# Altium project PCB_MAIN_BOARD.PrjPcb
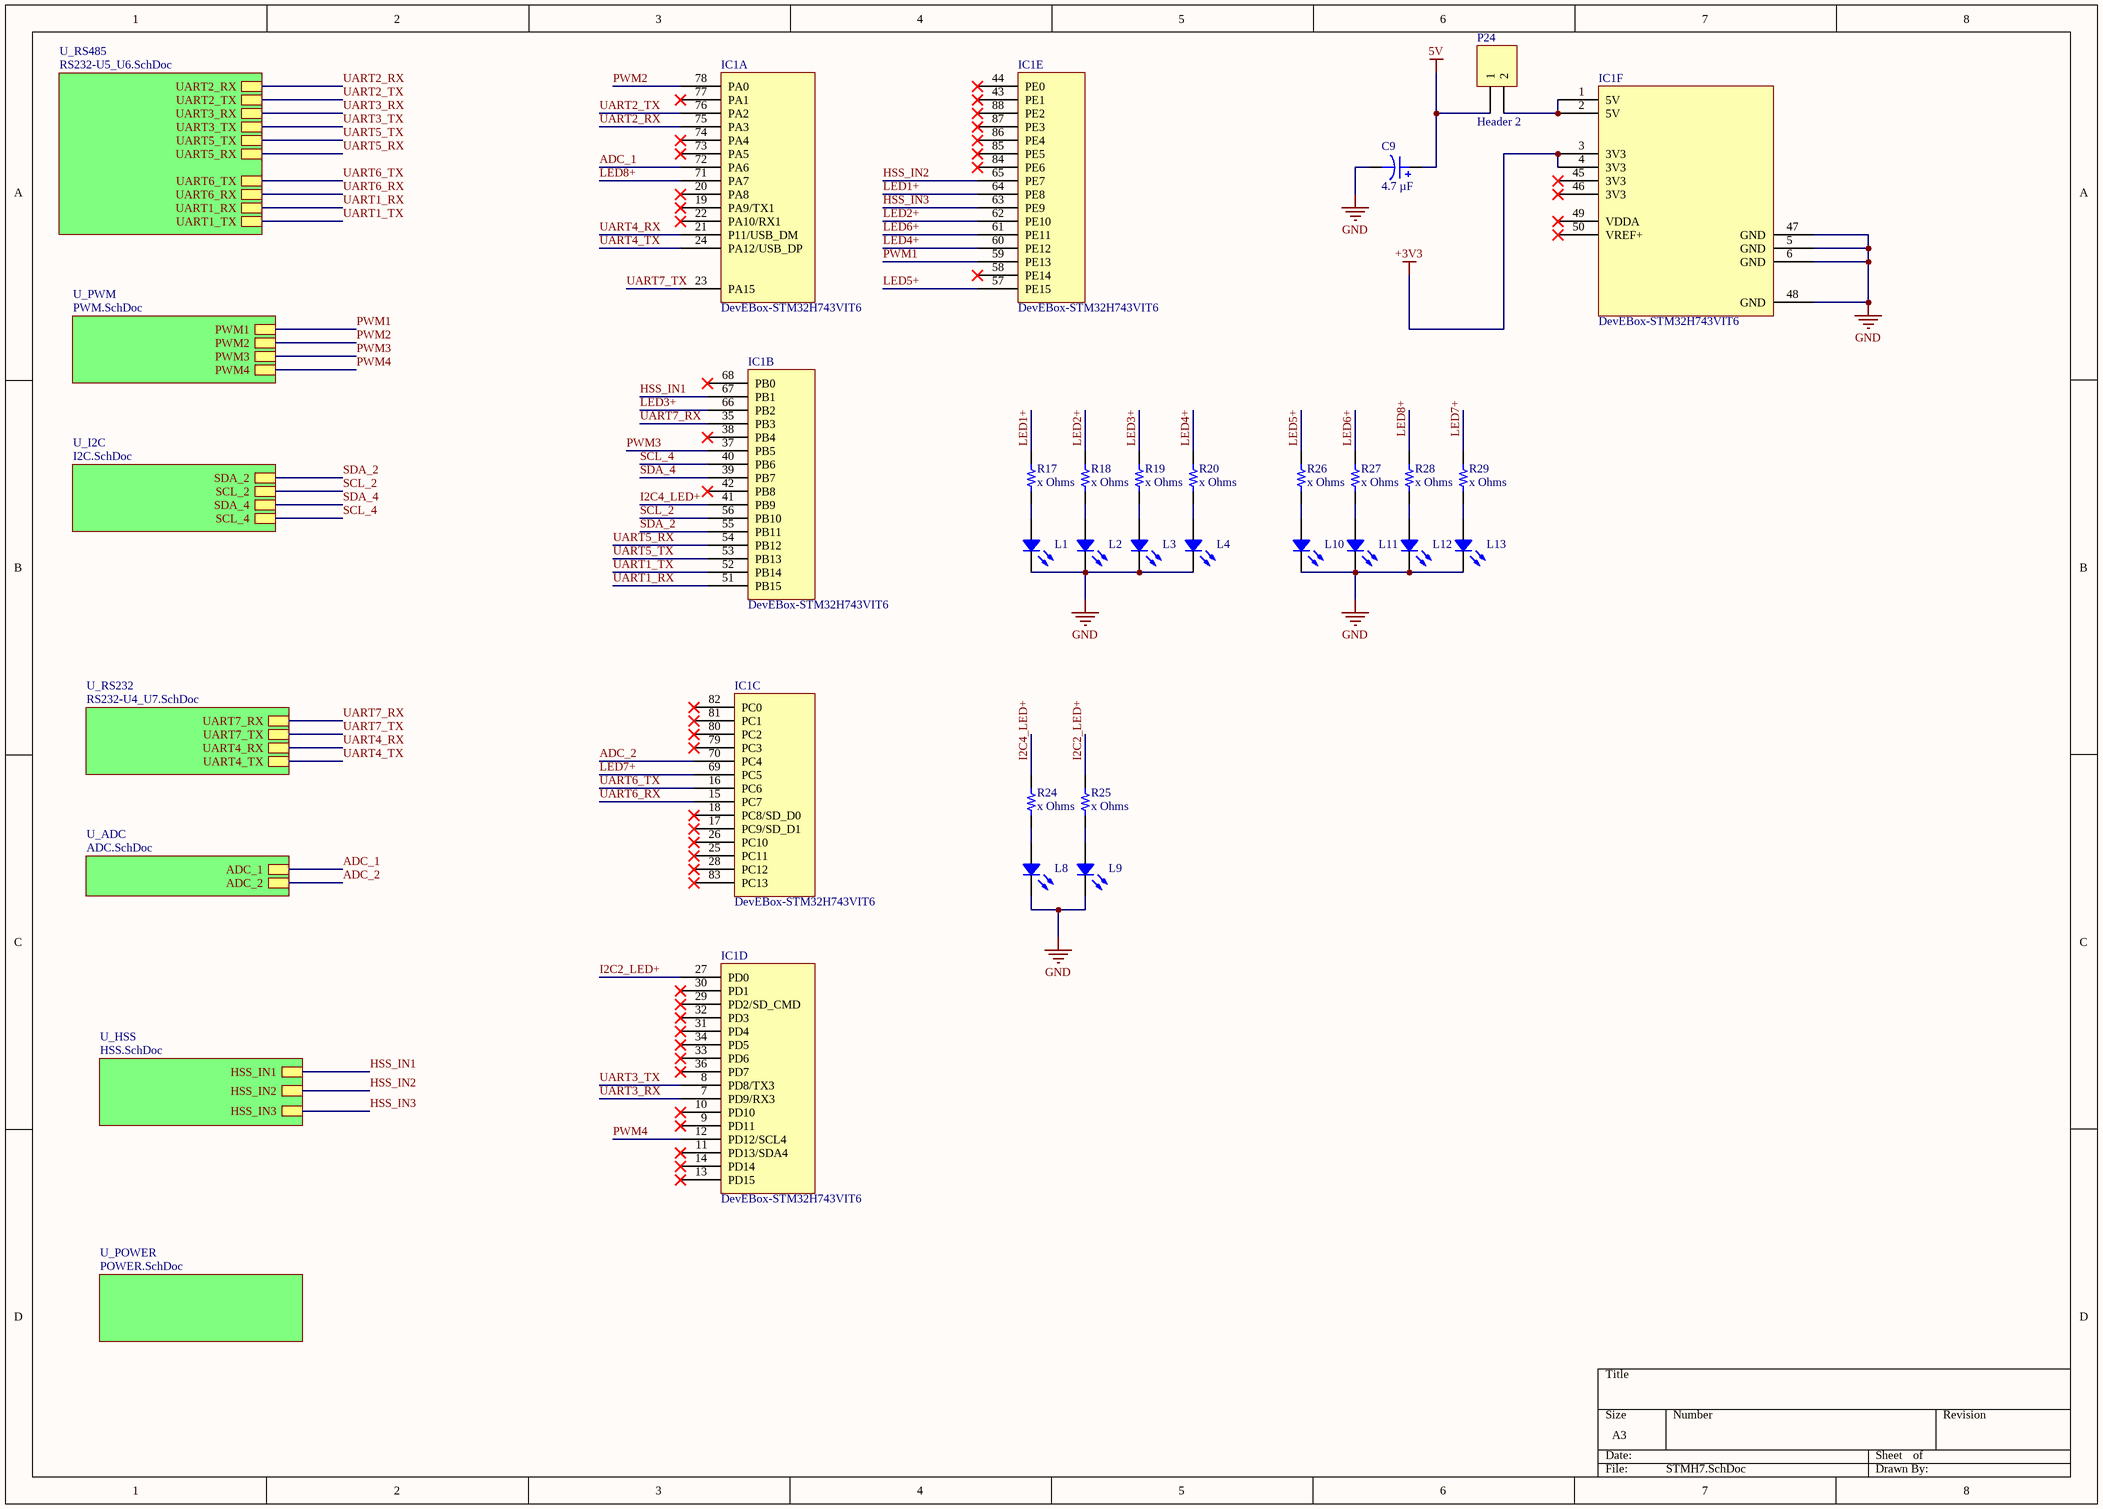
[diagram p0: STMH7.SchDoc]
8 sheets, 95 parts. Net scope: hierarchical (ports join the sheet entries above them; power ports are global).
Board file: MAINBOARD.PcbDoc
Sheets:
  STMH7.SchDoc
    U_RS232 = RS232-U4_U7.SchDoc
    U_RS485 = RS232-U5_U6.SchDoc
    U_PWM = PWM.SchDoc
    U_I2C = I2C.SchDoc
    U_ADC = ADC.SchDoc
    U_HSS = HSS.SchDoc
    U_POWER = POWER.SchDoc

## Sheet STMH7.SchDoc
size A3

### Parts
C9  4.7 µF  [CAP ALSMD 4.3MM H5.4MM]
IC1  DevEBox-STM32H743VIT6  [DevEBox-STM32H743VIT6]  (parts A,B,C,D,E,F of 6)
L1  LED_SMD  [LED_SMD]  (value not drawn)
L2  LED_SMD  [LED_SMD]  (value not drawn)
L3  LED_SMD  [LED_SMD]  (value not drawn)
L4  LED_SMD  [LED_SMD]  (value not drawn)
L8  LED_SMD  [LED_SMD]  (value not drawn)
L9  LED_SMD  [LED_SMD]  (value not drawn)
L10  LED_SMD  [LED_SMD]  (value not drawn)
L11  LED_SMD  [LED_SMD]  (value not drawn)
L12  LED_SMD  [LED_SMD]  (value not drawn)
L13  LED_SMD  [LED_SMD]  (value not drawn)
P24  Header 2  [HDR1X2]
R17  x Ohms  [RES 1206_3216 RF]
R18  x Ohms  [RES 1206_3216 RF]
R19  x Ohms  [RES 1206_3216 RF]
R20  x Ohms  [RES 1206_3216 RF]
R24  x Ohms  [RES 1206_3216 RF]
R25  x Ohms  [RES 1206_3216 RF]
R26  x Ohms  [RES 1206_3216 RF]
R27  x Ohms  [RES 1206_3216 RF]
R28  x Ohms  [RES 1206_3216 RF]
R29  x Ohms  [RES 1206_3216 RF]

### Sub-sheets
U_ADC = ADC.SchDoc: ADC_1, ADC_2
U_HSS = HSS.SchDoc: HSS_IN1, HSS_IN2, HSS_IN3
U_I2C = I2C.SchDoc: SDA_2, SCL_2, SDA_4, SCL_4
U_POWER = POWER.SchDoc: no entries
U_PWM = PWM.SchDoc: PWM1, PWM2, PWM4, PWM3
U_RS232 = RS232-U4_U7.SchDoc: UART7_RX, UART7_TX, UART4_RX, UART4_TX
U_RS485 = RS232-U5_U6.SchDoc: UART2_RX, UART2_TX, UART3_RX, UART3_TX, UART5_TX, UART5_RX, UART6_TX, UART6_RX, UART1_RX, UART1_TX

### Nets
5V: C9.1 P24.1
+3V3: IC1.3(3V3) IC1.4(3V3)
GND: C9.2 IC1.5(GND) IC1.6(GND) IC1.47(GND) IC1.48(GND) L1.2 L2.2 L3.2 L4.2 L8.2 L9.2 L10.2 L11.2 L12.2 L13.2
ADC_1: IC1.72(PA6) ; sheet U_ADC/ADC_1
ADC_2: IC1.70(PC4) ; sheet U_ADC/ADC_2
HSS_IN1: IC1.67(PB1) ; sheet U_HSS/HSS_IN1
HSS_IN2: IC1.65(PE7) ; sheet U_HSS/HSS_IN2
HSS_IN3: IC1.63(PE9) ; sheet U_HSS/HSS_IN3
I2C2_LED+: IC1.27(PD0) R25.2
I2C4_LED+: IC1.41(PB9) R24.2
LED1+: IC1.64(PE8) R17.2
LED2+: IC1.62(PE10) R18.2
LED3+: IC1.66(PB2) R19.2
LED4+: IC1.60(PE12) R20.2
LED5+: IC1.57(PE15) R26.2
LED6+: IC1.61(PE11) R27.2
LED7+: IC1.69(PC5) R29.2
LED8+: IC1.71(PA7) R28.2
PWM1: IC1.59(PE13) ; sheet U_PWM/PWM1
PWM2: IC1.78(PA0) ; sheet U_PWM/PWM2
PWM3: IC1.37(PB5) ; sheet U_PWM/PWM3
PWM4: IC1.12(PD12/SCL4) ; sheet U_PWM/PWM4
SCL_2: IC1.56(PB10) ; sheet U_I2C/SCL_2
SCL_4: IC1.40(PB6) ; sheet U_I2C/SCL_4
SDA_2: IC1.55(PB11) ; sheet U_I2C/SDA_2
SDA_4: IC1.39(PB7) ; sheet U_I2C/SDA_4
UART1_RX: IC1.51(PB15) ; sheet U_RS485/UART1_RX
UART1_TX: IC1.52(PB14) ; sheet U_RS485/UART1_TX
UART2_RX: IC1.75(PA3) ; sheet U_RS485/UART2_RX
UART2_TX: IC1.76(PA2) ; sheet U_RS485/UART2_TX
UART3_RX: IC1.7(PD9/RX3) ; sheet U_RS485/UART3_RX
UART3_TX: IC1.8(PD8/TX3) ; sheet U_RS485/UART3_TX
UART4_RX: IC1.21(P11/USB_DM) ; sheet U_RS232/UART4_RX
UART4_TX: IC1.24(PA12/USB_DP) ; sheet U_RS232/UART4_TX
UART5_RX: IC1.54(PB12) ; sheet U_RS485/UART5_RX
UART5_TX: IC1.53(PB13) ; sheet U_RS485/UART5_TX
UART6_RX: IC1.15(PC7) ; sheet U_RS485/UART6_RX
UART6_TX: IC1.16(PC6) ; sheet U_RS485/UART6_TX
UART7_RX: IC1.35(PB3) ; sheet U_RS232/UART7_RX
UART7_TX: IC1.23(PA15) ; sheet U_RS232/UART7_TX
NetIC1_1: IC1.1(5V) IC1.2(5V) P24.2
NetL1_1: L1.1 R17.1
NetL2_1: L2.1 R18.1
NetL3_1: L3.1 R19.1
NetL4_1: L4.1 R20.1
NetL8_1: L8.1 R24.1
NetL9_1: L9.1 R25.1
NetL10_1: L10.1 R26.1
NetL11_1: L11.1 R27.1
NetL12_1: L12.1 R28.1
NetL13_1: L13.1 R29.1

Not connected (* = marked no-connect by the designer): IC1 9(PD11)* 10(PD10)* 11(PD13/SDA4)* 13(PD15)* 14(PD14)* 17(PC9/SD_D1)* 18(PC8/SD_D0)* 19(PA9/TX1)* 20(PA8)* 22(PA10/RX1)* 25(PC11)* 26(PC10)* 28(PC12)* 29(PD2/SD_CMD)* 30(PD1)* 31(PD4)* 32(PD3)* 33(PD6)* 34(PD5)* 36(PD7)* 38(PB4)* 42(PB8)* 43(PE1)* 44(PE0)* 45(3V3)* 46(3V3)* 49(VDDA)* 50(VREF+)* 58(PE14)* 68(PB0)* 73(PA5)* 74(PA4)* 77(PA1)* 79(PC3)* 80(PC2)* 81(PC1)* 82(PC0)* 83(PC13)* 84(PE6)* 85(PE5)* 86(PE4)* 87(PE3)* 88(PE2)*

### Library data of the parts
C9 = EMVE350ADA4R7MD55G: CAP ALUM 4.7UF 20% 35V SMD; manufacturer: United Chemi-Con; Lifetime @ Temp.: 1000 Hrs @ 105°C; Polarization: Polar; Ripple Current @ Low Frequency: 16 mA @ 120 Hz; Surface Mount Land Size: 0.169" L x 0.169" W (4.30mm x 4.30mm); Part Number: EMVE350ADA4R7MD55G; Applications: General Purpose; Capacitance: 4.7 µF; componentlink1description: Datasheet; componentlink1url: //media.digikey.com/pdf/Data%20Sheets/United%20Chemi-Con%20PDFs/MVE%20Series.pdf; componentlink2description: DigiKey Link; componentlink2url: https://www.digikey.com/en/products/detail/united-chemi-con/EMVE350ADA4R7MD55G/756875; Device Package: Radial, Can - SMD; Height - Seated (Max): 0.205" (5.20mm); lastupdated: 15.03.2022 03:52:48; Lifecycle Status: Active; Minimum Order: 1; Mounting Type: Surface Mount; Operating Temperature: -40°C ~ 105°C; Package / Case: Radial, Can - SMD; packaging: TapeAndReel; partid: 7039; Part Status: Active; price: 0.09; series: Alchip™- MVE; Size / Dimension: 0.157" Dia (4.00mm); Supplier 1: DigiKey; Supplier Part Number 1: 565-2229-1-ND; Tolerance: ±20%; value: 4.7 µF; Voltage - Rated: 35 V
P24 = Header 2: Header, 2-Pin; LatestRevisionDate: 17-Jul-2002; LatestRevisionNote: Re-released for DXP Platform.; Publisher: Altium Limited
R17-R20 R24-R29 = RT1206BRD0749R9L: RES SMD 49.9 OHM 0.1% 1/4W 1206; Manufacturer: Yageo; Power (Watts): 0.25W, 1/4W; Resistance: 49.9 Ohms; Temperature Coefficient: ±25ppm/°C; Value: 49.9 Ohms; Part Number: RT1206BRD0749R9L; ComponentLink1Description: Datasheet; ComponentLink1URL: https://www.yageo.com/upload/media/product/productsearch/datasheet/rchip/PYu-RT_1-to-0.01_RoHS_L_11.pdf; ComponentLink2Description: DigiKey Link; ComponentLink2URL: https://www.digikey.com/en/products/detail/yageo/RT1206BRD0749R9L/1079849; Composition: Thin Film; Device Package: 1206 (3216 Metric); Height - Seated (Max): 0.026" (0.65mm); LastUpdated: 4.08.2022 05:00:43; Lifecycle Status: Active; Minimum Order: 1; Number of Terminations: 2; Operating Temperature: -55°C ~ 155°C; Package / Case: 1206 (3216 Metric); Packaging: TapeAndReel; PartId: 26863; Part Status: Active; Price: 0.10; Series: RT; Size / Dimension: 0.122" L x 0.063" W (3.10mm x 1.60mm); Supplier 1: DigiKey; Supplier Part Number 1: YAG5080CT-ND; Supplier Device Package: 1206; Tolerance: ±0.1%

## Sheet RS232-U4_U7.SchDoc: RS232
size A3; Date: 05.12.2021; CompanyName: ITU AUV; DrawnBy: SÜEDA KORKMAZ; Revision: 05.12.2021; Designed By: Süeda KORKMAZ
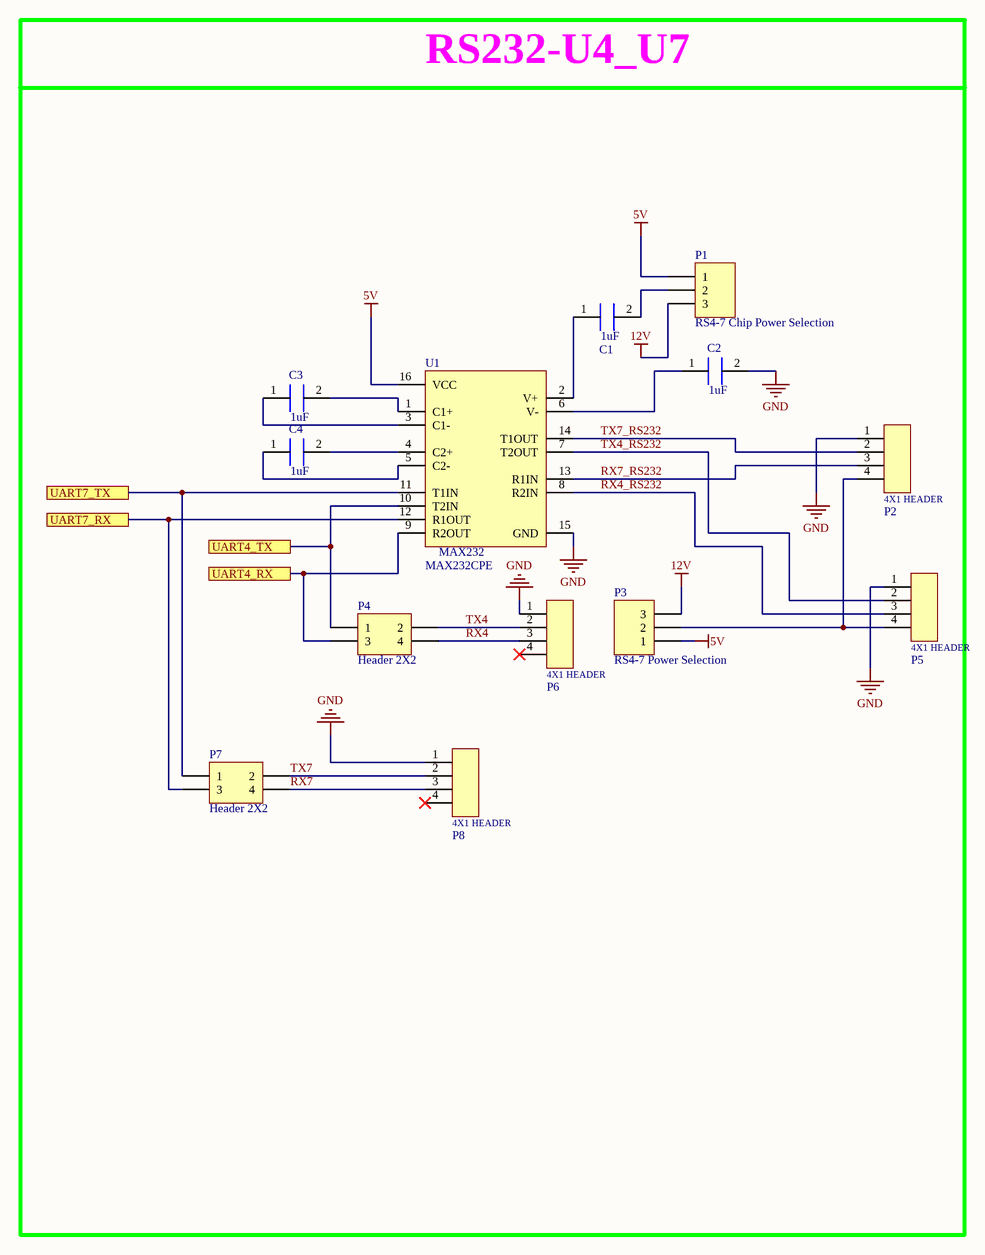
[diagram p1: RS232-U4_U7.SchDoc]

### Parts
C1  CAP CER 1UF 25V X7R 0805  [C0805C105J3RAC7800]  (value not drawn)
C2  CAP CER 1UF 25V X7R 0805  [C0805C105J3RAC7800]  (value not drawn)
C3  CAP CER 1UF 25V X7R 0805  [C0805C105J3RAC7800]  (value not drawn)
C4  CAP CER 1UF 25V X7R 0805  [C0805C105J3RAC7800]  (value not drawn)
P1  RS4-7 Chip Power Selection  [HDR1X3]
P2  WIRE-TO BOARD HEADER, 2.5MM, 4 C  [51125-04-0200-01]  (value not drawn)
P3  RS4-7 Power Selection  [HDR1X3]
P4  Header 2X2  [HDR2X2]
P5  WIRE-TO BOARD HEADER, 2.5MM, 4 C  [51125-04-0200-01]  (value not drawn)
P6  WIRE-TO BOARD HEADER, 2.5MM, 4 C  [51125-04-0200-01]  (value not drawn)
P7  Header 2X2  [HDR2X2]
P8  WIRE-TO BOARD HEADER, 2.5MM, 4 C  [51125-04-0200-01]  (value not drawn)
U1  MAX232CPE  [MAX232CPE]

### Blocks framed on the sheet
RS232-U4_U7: C1-C4 P1-P8 U1

### Ports
UART4_RX, UART4_TX, UART7_RX, UART7_TX

### Nets
5V: P1.1 P3.1 U1.16(VCC)
12V: P1.3 P3.3
GND: C2.2 P2.1 P5.1 P6.1 P8.1 U1.15(GND)
RX4: P4.4 P6.3
RX4_RS232: P5.3 U1.8(R2IN)
RX7: P7.4 P8.3
RX7_RS232: P2.3 U1.13(R1IN)
TX4: P4.2 P6.2
TX4_RS232: P5.2 U1.7(T2OUT)
TX7: P7.2 P8.2
TX7_RS232: P2.2 U1.14(T1OUT)
UART4_RX: P4.3 U1.9(R2OUT) ; port UART4_RX
UART4_TX: P4.1 U1.10(T2IN) ; port UART4_TX
UART7_RX: P7.3 U1.12(R1OUT) ; port UART7_RX
UART7_TX: P7.1 U1.11(T1IN) ; port UART7_TX
NetC1_1: C1.1 U1.2(V+)
NetC1_2: C1.2 P1.2
NetC2_1: C2.1 U1.6(V-)
NetC3_1: C3.1 U1.3(C1-)
NetC3_2: C3.2 U1.1(C1+)
NetC4_1: C4.1 U1.5(C2-)
NetC4_2: C4.2 U1.4(C2+)
NetP2_4: P2.4 P3.2 P5.4

Not connected (* = marked no-connect by the designer): P6 4(6)*; P8 4(6)*

### Notes on the sheet
- (in symbol 51125-04-0200-01) 4X1 HEADER

### Library data of the parts
C1-C4 = C0805C105J3RAC7800: Cap Ceramic 1uF 25V X7R 5% SMD 0805 125C Plastic T/R; Manufacturer: KEMET; Manufacturer Part Number: C0805C105J3RACTU; Supplier 1: Farnell; RoHS: Yes; Category: Ceramic Capacitors; Stock 1: 72500; Pricing 1: 2500=0,29500 (EUR); Mount: Surface Mount; Case/Package: 0805; Case Code (Metric): 2012; Case Code (Imperial): 0805; Dielectric Material: Ceramic; Min Operating Temperature: -55°C; Max Operating Temperature: 125°C; Package Quantity: 1; Capacitance: 1uF; Voltage Rating: 25V; Tolerance: 5%; Packaging: Tape and Reel; Voltage Rating (DC): 25V; Dielectric: X7R; Termination: SMD/SMT; Series: C; Length: 2mm; Width: 0.049inch; Thickness: 0.055inch; Depth: 1.25mm; Radiation Hardening: No; REACH SVHC: No SVHC; RoHS Compliant: Yes; ComponentLink1URL: http://components.arrow.com/part/dataview/46126037S66869N7429?src-supplier=Arrow+Electronics; ComponentLink1Description: http://components.arrow.com/part/dataview/46126037S66869N7429?src-supplier=Arrow+Electronics; ComponentLink2URL: http://www.farnell.com/datasheets/2745929.pdf?src-supplier=Farnell; ComponentLink2Description: http://www.farnell.com/datasheets/2745929.pdf?src-supplier=Farnell; ComponentLink3URL: http://www.mouser.com/ds/2/212/KEM_C1002_X7R_SMD-1102033.pdf?src-supplier=Mouser; ComponentLink3Description: http://www.mouser.com/ds/2/212/KEM_C1002_X7R_SMD-1102033.pdf?src-supplier=Mouser; ComponentLink4URL: http://components.arrow.com/part/dataview/0323_00011351?src-supplier=Arrow+Europe; ComponentLink4Description: http://components.arrow.com/part/dataview/0323_00011351?src-supplier=Arrow+Europe; ComponentLink5URL: https://api.kemet.com/component-edge/download/datasheet/C0805C105J3RACTU.pdf?src-supplier=Digi-Key; ComponentLink5Description: https://api.kemet.com/component-edge/download/datasheet/C0805C105J3RACTU.pdf?src-supplier=Digi-Key; ComponentLink6URL: http://www.farnell.com/datasheets/2745929.pdf?src-supplier=Newark; ComponentLink6Description: http://www.farnell.com/datasheets/2745929.pdf?src-supplier=Newark; ComponentLink7URL: http://www.farnell.com/datasheets/2745929.pdf?src-supplier=Element14; ComponentLink7Description: http://www.farnell.com/datasheets/2745929.pdf?src-supplier=Element14
P1 P3 = Header 3: Header, 3-Pin; LatestRevisionDate: 17-Jul-2002; LatestRevisionNote: Re-released for DXP Platform.; Publisher: Altium Limited
P2 = 51125-04-0200-01: RS7 Port; Manufacturer: CNC Tech; Supplier 1: Digi-Key; Manufacturer Part Number: 51125-04-0200-01; RoHS: No; Category: Connectors; Stock 1: 5369; Pricing 1: 1=0,21000, 10=0,17700, 100=0,13650, 500=0,11550, 1000=0,09450, 5000=0,08400, 10000=0,07613 (USD); Supplier Part Number 1: 1175-51125-04-0200-01-ND
P4 P7 = Header 2X2: Header, 2-Pin, Dual row; LatestRevisionDate: 17-Jul-2002; LatestRevisionNote: Re-released for DXP Platform.; Publisher: Altium Limited
P5 P6 P8 = 51125-04-0200-01: Manufacturer: CNC Tech; Supplier 1: Digi-Key; Manufacturer Part Number: 51125-04-0200-01; RoHS: No; Category: Connectors; Stock 1: 5369; Pricing 1: 1=0,21000, 10=0,17700, 100=0,13650, 500=0,11550, 1000=0,09450, 5000=0,08400, 10000=0,07613 (USD); Supplier Part Number 1: 1175-51125-04-0200-01-ND
U1 = MAX232CPE: MAX232 Series 120 kbps 5.5 V Through Hole RS-232 Transceiver - PDIP-16; Manufacturer: Maxim; Manufacturer Part Number: MAX232CPE+; Propagation Delay: 10us; Number of Transmitters: 2; Operating Supply Voltage: 5V; Min Supply Voltage: 4.5V; Max Supply Voltage: 5.5V; Operating Supply Current: 10mA; Number of Transceivers: 1; Supply Type: Single; Supplier 1: Farnell; RoHS: Yes; Category: RS-232 / RS-422 / RS-485 Interface ICs; Stock 1: 9660; Pricing 1: 1=4,80000, 10=3,86000, 25=3,63000, 50=3,48000, 100=3,32000, 250=3,29000, 500=3,24000 (EUR); Mount: Through Hole; Case/Package: PDIP; Number of Pins: 16; Weight: 0.056438oz; Contact Plating: Tin,Matte; Min Operating Temperature: 0°C; Max Operating Temperature: 70°C; Packaging: Rail/Tube; Package Quantity: 25; Number of Receivers: 2; Data Rate: 120Kbps; Interface: RS-232; Logic Function: Transceiver; Number of Drivers: 2; Type: Integrated Circuit (IC); Series: MAX232; Length: 19.43mm; Width: 7.87mm; Height: 4.45mm; Radiation Hardening: No; REACH SVHC: No SVHC; Lead Free: Lead Free; RoHS Compliant: Yes; ComponentLink1URL: https://datasheet.ciiva.com/22828/0900766b807c18c1-22828294.pdf?src-supplier=RSComponents; ComponentLink1Description: https://datasheet.ciiva.com/22828/0900766b807c18c1-22828294.pdf?src-supplier=RSComponents; ComponentLink2URL: https://datasheet.ciiva.com/29306/170049-da-01-en-ic-max232cpe-dip16-29306280.pdf?src-supplier=Conrad; ComponentLink2Description: https://datasheet.ciiva.com/29306/170049-da-01-en-ic-max232cpe-dip16-29306280.pdf?src-supplier=Conrad; ComponentLink3URL: https://datasheet.ciiva.com/26833/max232cpe-26833420.pdf?src-supplier=IIIC; ComponentLink3Description: https://datasheet.ciiva.com/26833/max232cpe-26833420.pdf?src-supplier=IIIC; ComponentLink4URL: https://datasheet.ciiva.com/26833/max232cpe-26833436.pdf?src-supplier=IIIC; ComponentLink4Description: https://datasheet.ciiva.com/26833/max232cpe-26833436.pdf?src-supplier=IIIC; ComponentLink5URL: https://datasheet.ciiva.com/18410/70157118-18410440.pdf?src-supplier=Allied+Electronics; ComponentLink5Description: https://datasheet.ciiva.com/18410/70157118-18410440.pdf?src-supplier=Allied+Electronics; ComponentLink6URL: https://datasheet.ciiva.com/3028/max220-max249-3028373.pdf?src-supplier=Avnet; ComponentLink6Description: https://datasheet.ciiva.com/3028/max220-max249-3028373.pdf?src-supplier=Avnet

## Sheet RS232-U5_U6.SchDoc
size A3
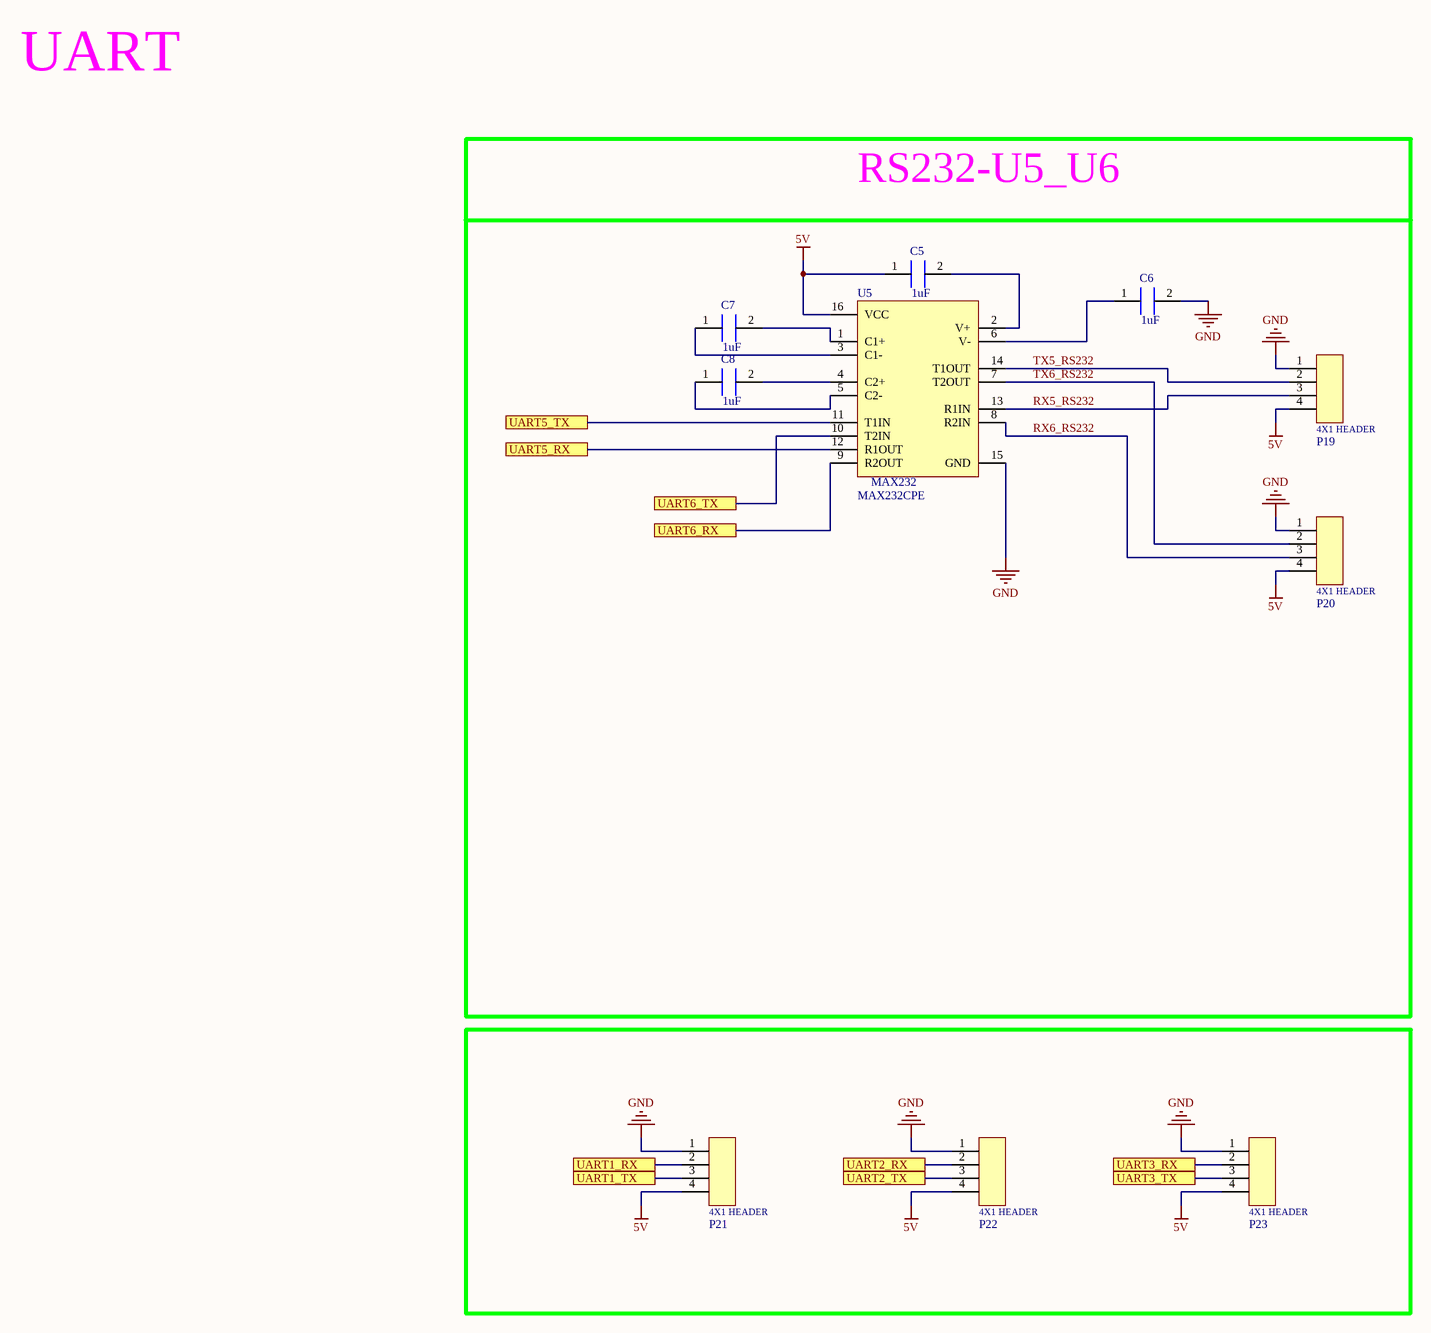
[diagram p2: RS232-U5_U6.SchDoc]

### Parts
C5  CAP CER 1UF 25V X7R 0805  [C0805C105J3RAC7800]  (value not drawn)
C6  CAP CER 1UF 25V X7R 0805  [C0805C105J3RAC7800]  (value not drawn)
C7  CAP CER 1UF 25V X7R 0805  [C0805C105J3RAC7800]  (value not drawn)
C8  CAP CER 1UF 25V X7R 0805  [C0805C105J3RAC7800]  (value not drawn)
P19  WIRE-TO BOARD HEADER, 2.5MM, 4 C  [51125-04-0200-01]  (value not drawn)
P20  WIRE-TO BOARD HEADER, 2.5MM, 4 C  [51125-04-0200-01]  (value not drawn)
P21  WIRE-TO BOARD HEADER, 2.5MM, 4 C  [51125-04-0200-01]  (value not drawn)
P22  WIRE-TO BOARD HEADER, 2.5MM, 4 C  [51125-04-0200-01]  (value not drawn)
P23  WIRE-TO BOARD HEADER, 2.5MM, 4 C  [51125-04-0200-01]  (value not drawn)
U5  MAX232CPE  [MAX232CPE]

### Blocks framed on the sheet
RS232-U5_U6: C5-C8 P19 P20 U5

### Ports
UART1_RX, UART1_TX, UART2_RX, UART2_TX, UART3_RX, UART3_TX, UART5_RX, UART5_TX, UART6_RX, UART6_TX

### Nets
5V: C5.1 P19.4 P20.4 P21.4 P22.4 P23.4 U5.16(VCC)
GND: C6.2 P19.1 P20.1 P21.1 P22.1 P23.1 U5.15(GND)
RX5_RS232: P19.3 U5.13(R1IN)
RX6_RS232: P20.3 U5.8(R2IN)
TX5_RS232: P19.2 U5.14(T1OUT)
TX6_RS232: P20.2 U5.7(T2OUT)
UART1_RX: P21.2 ; port UART1_RX
UART1_TX: P21.3 ; port UART1_TX
UART2_RX: P22.2 ; port UART2_RX
UART2_TX: P22.3 ; port UART2_TX
UART3_RX: P23.2 ; port UART3_RX
UART3_TX: P23.3 ; port UART3_TX
UART5_RX: U5.12(R1OUT) ; port UART5_RX
UART5_TX: U5.11(T1IN) ; port UART5_TX
UART6_RX: U5.9(R2OUT) ; port UART6_RX
UART6_TX: U5.10(T2IN) ; port UART6_TX
NetC5_2: C5.2 U5.2(V+)
NetC6_1: C6.1 U5.6(V-)
NetC7_1: C7.1 U5.3(C1-)
NetC7_2: C7.2 U5.1(C1+)
NetC8_1: C8.1 U5.5(C2-)
NetC8_2: C8.2 U5.4(C2+)

### Notes on the sheet
- UART
- (in symbol 51125-04-0200-01) 4X1 HEADER

### Library data of the parts
C5-C8 = C0805C105J3RAC7800: as C1 on sheet RS232-U4_U7; Supplier 1: Farnell; RoHS: Yes; Category: Ceramic Capacitors; Stock 1: 72500; Pricing 1: 2500=0,29500 (EUR); Mount: Surface Mount; Case/Package: 0805; Case Code (Metric): 2012; Case Code (Imperial): 0805; Dielectric Material: Ceramic; Min Operating Temperature: -55°C; Max Operating Temperature: 125°C; Package Quantity: 1; Capacitance: 1uF; Voltage Rating: 25V; Tolerance: 5%; Packaging: Tape and Reel; Voltage Rating (DC): 25V; Dielectric: X7R; Termination: SMD/SMT; Series: C; Length: 2mm; Width: 0.049inch; Thickness: 0.055inch; Depth: 1.25mm; Radiation Hardening: No; REACH SVHC: No SVHC; RoHS Compliant: Yes; ComponentLink1URL: http://components.arrow.com/part/dataview/46126037S66869N7429?src-supplier=Arrow+Electronics; ComponentLink1Description: http://components.arrow.com/part/dataview/46126037S66869N7429?src-supplier=Arrow+Electronics; ComponentLink2URL: http://www.farnell.com/datasheets/2745929.pdf?src-supplier=Farnell; ComponentLink2Description: http://www.farnell.com/datasheets/2745929.pdf?src-supplier=Farnell; ComponentLink3URL: http://www.mouser.com/ds/2/212/KEM_C1002_X7R_SMD-1102033.pdf?src-supplier=Mouser; ComponentLink3Description: http://www.mouser.com/ds/2/212/KEM_C1002_X7R_SMD-1102033.pdf?src-supplier=Mouser; ComponentLink4URL: http://components.arrow.com/part/dataview/0323_00011351?src-supplier=Arrow+Europe; ComponentLink4Description: http://components.arrow.com/part/dataview/0323_00011351?src-supplier=Arrow+Europe; ComponentLink5URL: https://api.kemet.com/component-edge/download/datasheet/C0805C105J3RACTU.pdf?src-supplier=Digi-Key; ComponentLink5Description: https://api.kemet.com/component-edge/download/datasheet/C0805C105J3RACTU.pdf?src-supplier=Digi-Key; ComponentLink6URL: http://www.farnell.com/datasheets/2745929.pdf?src-supplier=Newark; ComponentLink6Description: http://www.farnell.com/datasheets/2745929.pdf?src-supplier=Newark; ComponentLink7URL: http://www.farnell.com/datasheets/2745929.pdf?src-supplier=Element14; ComponentLink7Description: http://www.farnell.com/datasheets/2745929.pdf?src-supplier=Element14
P19-P23 = 51125-04-0200-01: Manufacturer: CNC Tech; Supplier 1: Digi-Key; Manufacturer Part Number: 51125-04-0200-01; RoHS: No; Category: Connectors; Stock 1: 5369; Pricing 1: 1=0,21000, 10=0,17700, 100=0,13650, 500=0,11550, 1000=0,09450, 5000=0,08400, 10000=0,07613 (USD); Supplier Part Number 1: 1175-51125-04-0200-01-ND
U5 = MAX232CPE: as U1 on sheet RS232-U4_U7; Supplier 1: Farnell; RoHS: Yes; Category: RS-232 / RS-422 / RS-485 Interface ICs; Stock 1: 9660; Pricing 1: 1=4,80000, 10=3,86000, 25=3,63000, 50=3,48000, 100=3,32000, 250=3,29000, 500=3,24000 (EUR); Mount: Through Hole; Case/Package: PDIP; Number of Pins: 16; Weight: 0.056438oz; Contact Plating: Tin,Matte; Min Operating Temperature: 0°C; Max Operating Temperature: 70°C; Packaging: Rail/Tube; Package Quantity: 25; Number of Receivers: 2; Data Rate: 120Kbps; Interface: RS-232; Logic Function: Transceiver; Number of Drivers: 2; Type: Integrated Circuit (IC); Series: MAX232; Length: 19.43mm; Width: 7.87mm; Height: 4.45mm; Radiation Hardening: No; REACH SVHC: No SVHC; Lead Free: Lead Free; RoHS Compliant: Yes; ComponentLink1URL: https://datasheet.ciiva.com/22828/0900766b807c18c1-22828294.pdf?src-supplier=RSComponents; ComponentLink1Description: https://datasheet.ciiva.com/22828/0900766b807c18c1-22828294.pdf?src-supplier=RSComponents; ComponentLink2URL: https://datasheet.ciiva.com/29306/170049-da-01-en-ic-max232cpe-dip16-29306280.pdf?src-supplier=Conrad; ComponentLink2Description: https://datasheet.ciiva.com/29306/170049-da-01-en-ic-max232cpe-dip16-29306280.pdf?src-supplier=Conrad; ComponentLink3URL: https://datasheet.ciiva.com/26833/max232cpe-26833420.pdf?src-supplier=IIIC; ComponentLink3Description: https://datasheet.ciiva.com/26833/max232cpe-26833420.pdf?src-supplier=IIIC; ComponentLink4URL: https://datasheet.ciiva.com/26833/max232cpe-26833436.pdf?src-supplier=IIIC; ComponentLink4Description: https://datasheet.ciiva.com/26833/max232cpe-26833436.pdf?src-supplier=IIIC; ComponentLink5URL: https://datasheet.ciiva.com/18410/70157118-18410440.pdf?src-supplier=Allied+Electronics; ComponentLink5Description: https://datasheet.ciiva.com/18410/70157118-18410440.pdf?src-supplier=Allied+Electronics; ComponentLink6URL: https://datasheet.ciiva.com/3028/max220-max249-3028373.pdf?src-supplier=Avnet; ComponentLink6Description: https://datasheet.ciiva.com/3028/max220-max249-3028373.pdf?src-supplier=Avnet

## Sheet PWM.SchDoc
size A3
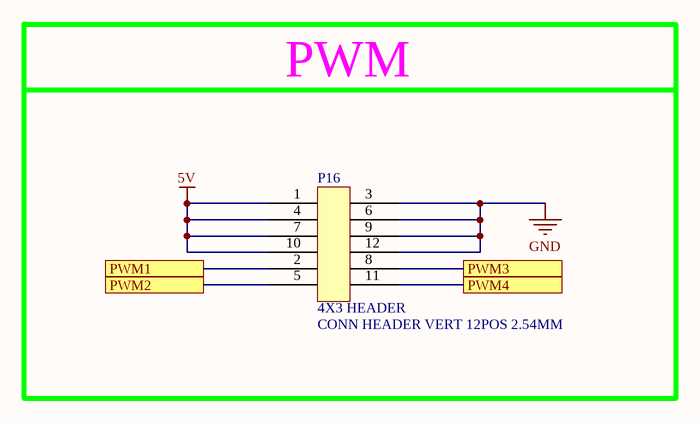
[diagram p3: PWM.SchDoc]

### Parts
P16  CONN HEADER VERT 12POS 2.54MM  [TSW-104-23-L-T]

### Blocks framed on the sheet
PWM: P16

### Ports
PWM1, PWM2, PWM3, PWM4

### Nets
5V: P16.1 P16.4 P16.7 P16.10
GND: P16.3 P16.6 P16.9 P16.12
PWM1: P16.2 ; port PWM1
PWM2: P16.5 ; port PWM2
PWM3: P16.8 ; port PWM3
PWM4: P16.11 ; port PWM4

### Notes on the sheet
- (in symbol TSW-104-23-L-T) 4X3 HEADER

### Library data of the parts
P16 = TSW-104-23-L-T

## Sheet I2C.SchDoc: ITU AUV MAIN BOARD
size A3; DocumentNumber: 1; SheetNumber: 1
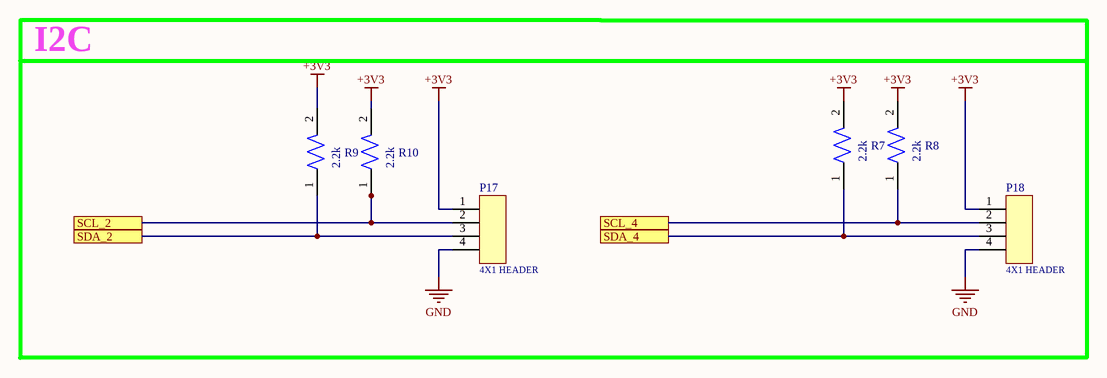
[diagram p4: I2C.SchDoc]

### Parts
P17  CONN HEADER SMD R/A 4POS 1.25MM  [DF13-4P-1.25V]  (value not drawn)
P18  CONN HEADER SMD R/A 4POS 1.25MM  [DF13-4P-1.25V]  (value not drawn)
R7  Dip resistor  [Resistor DIP]  (value not drawn)
R8  Dip resistor  [Resistor DIP]  (value not drawn)
R9  Dip resistor  [Resistor DIP]  (value not drawn)
R10  Dip resistor  [Resistor DIP]  (value not drawn)

### Blocks framed on the sheet
I2C: P17 P18 R7-R10

### Ports
SCL_2, SCL_4, SDA_2, SDA_4

### Nets
+3V3: P17.1 P18.1 R7.2 R8.2 R9.2 R10.2
GND: P17.4 P18.4
SCL_2: P17.2 R10.1 ; port SCL_2
SCL_4: P18.2 R8.1 ; port SCL_4
SDA_2: P17.3 R9.1 ; port SDA_2
SDA_4: P18.3 R7.1 ; port SDA_4

### Notes on the sheet
- (in symbol 2.2k dip) 2.2k
- (in symbol DF13-4P-1.25H(21)) 4X1 HEADER

### Library data of the parts
P17 P18 = DF13-4P-1.25H(21): Conn Shrouded Header HDR 4 POS 1.25mm Solder RA SMD Embossed T/R; Manufacturer: Hirose; Number of Contacts: 4; Current Rating: 1A; Connector Type: Male Pin; Voltage Rating (AC): 150V; Designed By: Süeda KORKMAZ; Supplier 1: Digi-Key; Manufacturer Part Number: DF13-4P-1.25H(21); RoHS: Yes; Category: Headers and Wire Housings; Stock 1: 39973; Pricing 1: 1=0,57000, 10=0,50100, 100=0,41300, 500=0,35910 (USD); Mount: Surface Mount; Color: Beige; Contact Plating: Tin; Contact Material: Brass; Housing Color: Beige; Housing Material: Polyamide; Number of Rows: 1; Termination: Solder; Package Quantity: 1000; Packaging: Tape and Reel; Number of Positions: 4; Length: 9.65mm; Height: 3.6mm; Pitch: 1.25mm; Radiation Hardening: No; Lead Free: Lead Free; ComponentLink1URL: https://datasheet.ciiva.com/5162/en-df13-20130411-268487-5162328.pdf?src-supplier=Mouser; ComponentLink1Description: https://datasheet.ciiva.com/5162/en-df13-20130411-268487-5162328.pdf?src-supplier=Mouser; Supplier Part Number 1: 26-DF13-4P-1.25H(21)CT-ND
R7-R10 = 2.2k dip: Manufacturer: Vishay; Manufacturer Part Number: CRCW06032K20FKEAHP; Resistance: 2.2kR; Tolerance: 1%; Temperature Coefficient: 100ppm/°C; Power Rating: 250mW; Voltage Rating: 75V; RoHS: Yes; Category: Chip SMD Resistors; Stock 1: 19777; Pricing 1: 1=0,17000, 10=0,14800, 100=0,05790, 1000=0,02422, 2500=0,02220 (USD); Mount: Surface Mount; Case/Package: 0603; Contact Plating: Tin; Case Code (Metric): 1608; Case Code (Imperial): 0603; Min Operating Temperature: -55°C; Max Operating Temperature: 155°C; Resistor Type: Thick Film; Packaging: Tape and Reel; Package Quantity: 1; Number of Terminations: 2; Termination: Solder; Max Power Dissipation: 250mW; Voltage Rating (DC): 75V; Features: Automotive AEC-Q200; Series: CRCW-HP; Construction: Rectangular; Technology: THICK FILM; Resistance Tolerance: 1%; Length: 1.6mm; Width: 0.033inch; Height: 0.02inch; Depth: 0.85mm; Radiation Hardening: No; REACH SVHC: Unknown; Military Standard: Not; Lead Free: Lead Free; RoHS Compliant: Yes

## Sheet ADC.SchDoc
size A3
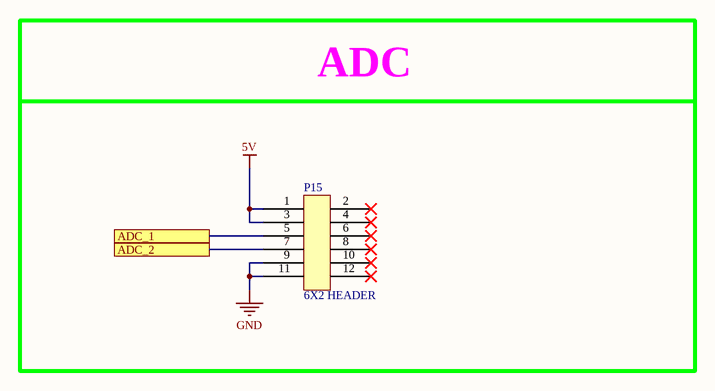
[diagram p5: ADC.SchDoc]

### Parts
P15  CONN HEADER VERT 12POS 2.54MM  [281739-6]  (value not drawn)

### Blocks framed on the sheet
ADC: P15

### Ports
ADC_1, ADC_2

### Nets
5V: P15.1 P15.3
GND: P15.9 P15.11
ADC_1: P15.5 ; port ADC_1
ADC_2: P15.7 ; port ADC_2

Not connected (* = marked no-connect by the designer): P15 2* 4* 6* 8* 10* 12*

### Notes on the sheet
- (in symbol 281739-6) 6X2 HEADER

### Library data of the parts
P15 = 281739-6: Conn Shrouded Header HDR 12 POS 2.54mm Solder ST Thru-Hole Loose Piece; Manufacturer: TE Connectivity; Current Rating: 3A; Number of Poles: 12; Contact Resistance: 15mR; Mating Cycles: 30; Insulation Resistance: 1GR; Working Voltage: 500V; Connector Type: Plug,Header,Pin; Gender: Male; Board Standoff: No (Without); Contact Protection: Yes (With); Keyed: No; PCB Mount Retention: Without; PCB Mounting Orientation: Vertical; Contact Post Length: 2.9mm; Hole Diameter: 1mm; Supplier 1: Digi-Key; Manufacturer Part Number: 281739-6; RoHS: Yes; Category: Headers and Wire Housings; Stock 1: 2109; Pricing 1: 1=2,80000, 10=2,54500, 100=2,24220, 500=1,90586, 1000=1,62559, 5000=1,49479 (USD); Mount: Through Hole; Contact Plating: Tin; Color: Blue; Material: Glass,Polyester; Insulation Material: Thermoplastic; Contact Material: Bronze; Housing Color: Blue; Housing Material: Thermoplastic; Contact Shape: Square; Contact Finish - Mating: TIN; Insulation Color: Blue; Min Operating Temperature: -55°C; Max Operating Temperature: 105°C; Number of Rows: 2; Package Quantity: 2000; Termination: Through Hole; Number of Contacts: 12; Series: HE13/HE14; Packaging: Box; Contact Gender: Male; Number of Positions: 12; Orientation: Straight; Gasket: No (Without); Mating Alignment: No (Without); Mating Connector Lock: No (Without); Selectively Loaded: No (Without); Stabilizers: No (Without); Strain Relief: No (Without); Contact Current Rating: 3A; Fastening Type: Friction; Contact Type: Male Pin; Length: 15.24mm; Pitch: 2.54mm; Lead Pitch: 2.54mm; Row Spacing: 2.54mm; Contact Mating Length: 6.75mm; Depth: 7.62mm; Shrouded End Dimension: 1.27mm; Radiation Hardening: No; REACH SVHC: No SVHC; RoHS Compliant: Yes; Flammability Rating: UL94 V-0; ELV: Compliant; ComponentLink1URL: https://datasheet.ciiva.com/11748/0900766b8124a6f5-11748092.pdf?src-supplier=RSComponents; ComponentLink1Description: https://datasheet.ciiva.com/11748/0900766b8124a6f5-11748092.pdf?src-supplier=RSComponents; ComponentLink2URL: https://datasheet.ciiva.com/41447/001173320-da-01-ml-he14-stiftleiste-0-0281739-6-en-fr-41447806.pdf?src-supplier=Conrad; ComponentLink2Description: https://datasheet.ciiva.com/41447/001173320-da-01-ml-he14-stiftleiste-0-0281739-6-en-fr-41447806.pdf?src-supplier=Conrad; ComponentLink3URL: https://datasheet.ciiva.com/7212/23844-7212941.pdf?src-supplier=Newark; ComponentLink3Description: https://datasheet.ciiva.com/7212/23844-7212941.pdf?src-supplier=Newark; ComponentLink4URL: https://datasheet.ciiva.com/731/eng-cd-281739-g1-731286.pdf?src-supplier=Digi-Key; ComponentLink4Description: https://datasheet.ciiva.com/731/eng-cd-281739-g1-731286.pdf?src-supplier=Digi-Key; Supplier Part Number 1: A121458-ND

## Sheet HSS.SchDoc
size A3
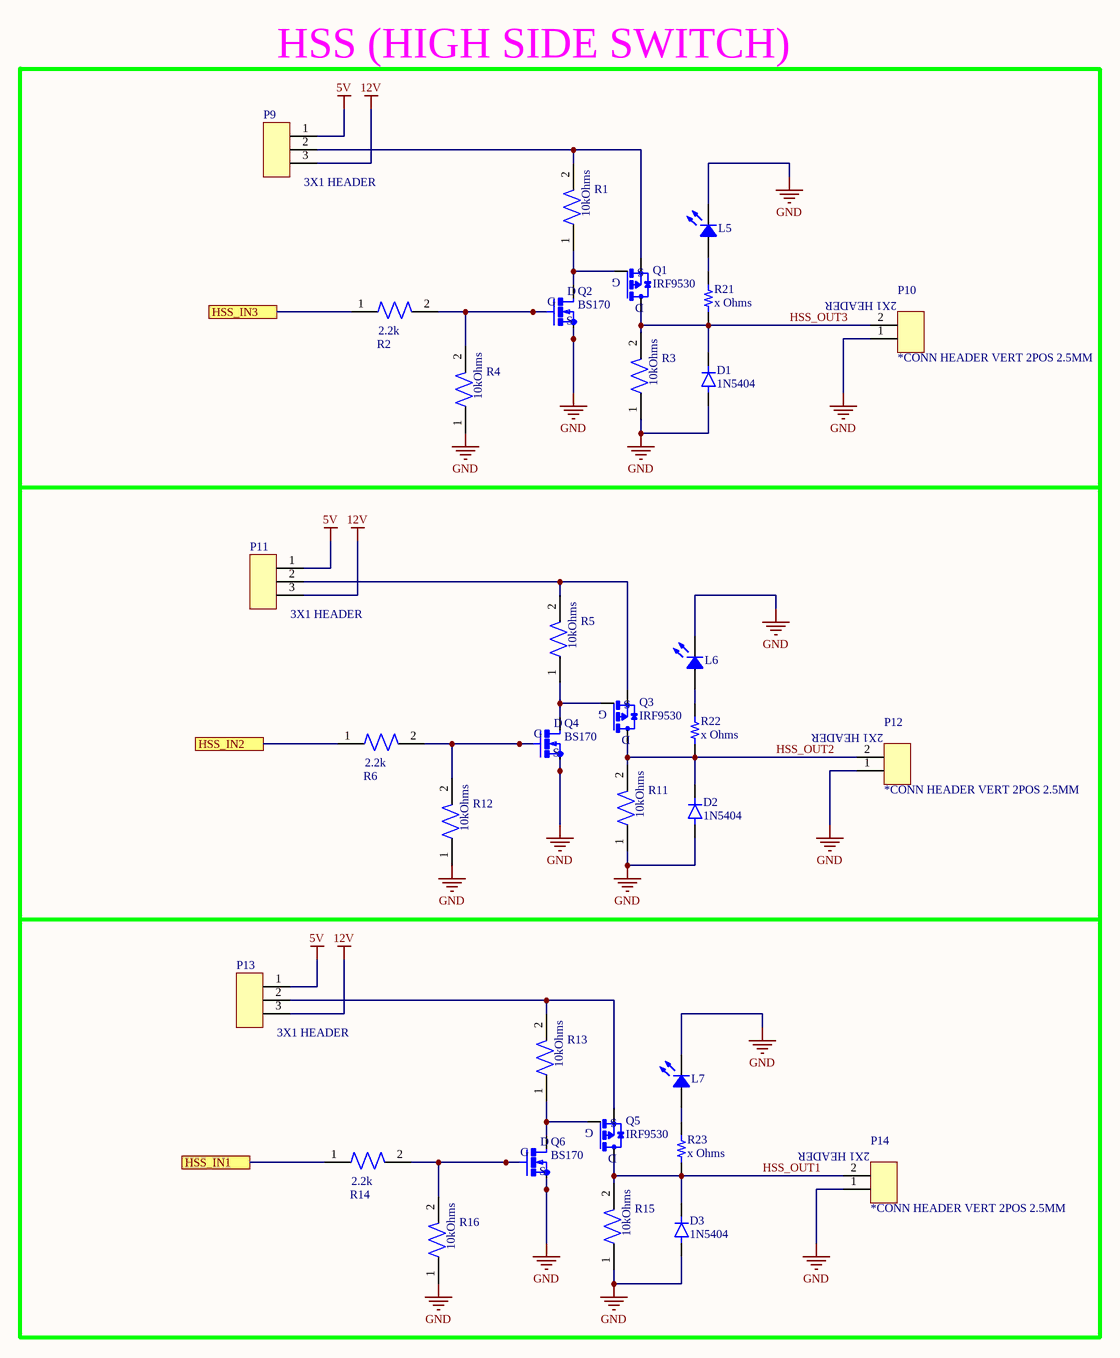
[diagram p6: HSS.SchDoc]

### Parts
D1  1N5404  [DIOAD1990W125L900D530]
D2  1N5404  [DIOAD1990W125L900D530]
D3  1N5404  [DIOAD1990W125L900D530]
L5  LED_SMD  [LED_SMD]  (value not drawn)
L6  LED_SMD  [LED_SMD]  (value not drawn)
L7  LED_SMD  [LED_SMD]  (value not drawn)
P9  CONN HEADER VERT 3POS 2.5MM  [2132230-3]  (value not drawn)
P10  *CONN HEADER VERT 2POS 2.5MM  [51025-02-0100-01]
P11  CONN HEADER VERT 3POS 2.5MM  [2132230-3]  (value not drawn)
P12  *CONN HEADER VERT 2POS 2.5MM  [51025-02-0100-01]
P13  CONN HEADER VERT 3POS 2.5MM  [2132230-3]  (value not drawn)
P14  *CONN HEADER VERT 2POS 2.5MM  [51025-02-0100-01]
Q1  IRF9530  [DPAK508P1524X483-3N]
Q2  BS170  [SOT91P240X120-3N]
Q3  IRF9530  [DPAK508P1524X483-3N]
Q4  BS170  [SOT91P240X120-3N]
Q5  IRF9530  [DPAK508P1524X483-3N]
Q6  BS170  [SOT91P240X120-3N]
R1  RES 10K OHM 1% 1/8W 0805  [RES 1206_3216 RF]  (value not drawn)
R2  RES 10K OHM 1% 1/8W 0805  [RES 0805_2012]  (value not drawn)
R3  RES 10K OHM 1% 1/8W 0805  [RES 1206_3216 RF]  (value not drawn)
R4  RES 10K OHM 1% 1/8W 0805  [RES 1206_3216 RF]  (value not drawn)
R5  RES 10K OHM 1% 1/8W 0805  [RES 1206_3216 RF]  (value not drawn)
R6  RES 10K OHM 1% 1/8W 0805  [RES 0805_2012]  (value not drawn)
R11  RES 10K OHM 1% 1/8W 0805  [RES 1206_3216 RF]  (value not drawn)
R12  RES 10K OHM 1% 1/8W 0805  [RES 1206_3216 RF]  (value not drawn)
R13  RES 10K OHM 1% 1/8W 0805  [RES 1206_3216 RF]  (value not drawn)
R14  RES 10K OHM 1% 1/8W 0805  [RES 0805_2012]  (value not drawn)
R15  RES 10K OHM 1% 1/8W 0805  [RES 1206_3216 RF]  (value not drawn)
R16  RES 10K OHM 1% 1/8W 0805  [RES 1206_3216 RF]  (value not drawn)
R21  x Ohms  [RES 1206_3216 RF]
R22  x Ohms  [RES 1206_3216 RF]
R23  x Ohms  [RES 1206_3216 RF]

### Blocks framed on the sheet
HSS (HIGH SIDE SWITCH): D1-D3 L5-L7 P9-P14 Q1-Q6 R1-R6 R11-R16 R21-R23

### Ports
HSS_IN1, HSS_IN2, HSS_IN3

### Nets
5V: P9.1 P11.1 P13.1
12V: P9.3 P11.3 P13.3
GND: D1.A D2.A D3.A L5.2 L6.2 L7.2 P10.1 P12.1 P14.1 Q2.S Q4.S Q6.S R3.1 R4.1 R11.1 R12.1 R15.1 R16.1
HSS_IN1: R14.1 ; port HSS_IN1
HSS_IN2: R6.1 ; port HSS_IN2
HSS_IN3: R2.1 ; port HSS_IN3
HSS_OUT1: D3.C(K) P14.2 Q5.2(D) R15.2 R23.2
HSS_OUT2: D2.C(K) P12.2 Q3.2(D) R11.2 R22.2
HSS_OUT3: D1.C(K) P10.2 Q1.2(D) R3.2 R21.2
NetL5_1: L5.1 R21.1
NetL6_1: L6.1 R22.1
NetL7_1: L7.1 R23.1
NetP9_2: P9.2 Q1.3(S) R1.2
NetP11_2: P11.2 Q3.3(S) R5.2
NetP13_2: P13.2 Q5.3(S) R13.2
NetQ1_1: Q1.1(G) Q2.D R1.1
NetQ2_G: Q2.G R2.2 R4.2
NetQ3_1: Q3.1(G) Q4.D R5.1
NetQ4_G: Q4.G R6.2 R12.2
NetQ5_1: Q5.1(G) Q6.D R13.1
NetQ6_G: Q6.G R14.2 R16.2

### Notes on the sheet
- (in symbol 2.2k dip) 2.2k
- (in symbol 2132230-3) 3X1 HEADER
- (in symbol B2B-XH-AM(LF)(SN)) 2X1 HEADER
- (in symbol RC0805FR-1310KL) 10kOhms

### Library data of the parts
D1-D3 = 1N5404: Diode Standard 400 V 3A Through Hole DO-201AD; MF: ON Semiconductor; Purchase-URL: https://pricing.snapeda.com/search/part/1N5404/?ref=eda; Price: None; Check_prices: https://www.snapeda.com/parts/1N5404/Onsemi/view-part/?ref=eda; MP: 1N5404; Value: *; Package: AXIAL LEAD-2 ON Semiconductor; SnapEDA_Link: https://www.snapeda.com/parts/1N5404/Onsemi/view-part/?ref=snap; Availability: In Stock
P9 P11 P13 = 2132230-3: Conn Shrouded Header HDR 3Power POS 2.5mm Solder ST Top Entry Thru-Hole Bag; Manufacturer: TE Connectivity; Connector Type: Plug,Header,Pin; Gender: Male; Contact Current Rating: 4.2A; Backwall/Post Interruptions: No (Without); Connector System: Wire-to-Board; Mating Alignment: Yes (With); Voltage Rating: 250V; Current Rating: 3A; Contact Style: Straight; Number of Positions: 3; PCB Mount Retention: Without; PCB Mounting Orientation: Vertical; Plating Thickness: 2.032um; PCB Thickness: 0.063inch; Tail Length: 3.4mm; Supplier 1: Digi-Key; Manufacturer Part Number: 2132230-3; RoHS: Yes; Category: Headers and Wire Housings; Stock 1: 3045; Pricing 1: 1=0,30000, 10=0,25700, 100=0,19970, 500=0,17120, 1000=0,14266, 5000=0,12228, 10000=0,11413 (USD); Mount: Through Hole; Housing Material: Nylon; Housing Color: White; Contact Shape: Square; Contact Material: Brass; Contact Plating: Tin; Color: Natural; Min Operating Temperature: -55°C; Max Operating Temperature: 105°C; Orientation: Straight; Contact Retention: No (Without); Mating Retention: Yes (With); PCB Mount Alignment: Yes (With); Sealable: No (Without); Selectively Loaded: No (Without); Number of Rows: 1; Contact Gender: Male; Package Quantity: 600; Max Voltage Rating (AC): 250V; Packaging: Bag; Termination: Solder; Number of Contacts: 3; Length: 10mm; Width: 6.4mm; Height: 8.8mm; Pitch: 2.5mm; Contact Mating Length: 3.6mm; Depth: 6.4mm; Radiation Hardening: No; ELV: Compliant; Flammability Rating: UL94 V-0; REACH SVHC: No SVHC; Lead Free: Lead Free; ComponentLink1URL: https://datasheet.ciiva.com/12501/ng-cd-2132230-d2-18263-12501858.pdf?src-supplier=Mouser; ComponentLink1Description: https://datasheet.ciiva.com/12501/ng-cd-2132230-d2-18263-12501858.pdf?src-supplier=Mouser; ComponentLink2URL: https://datasheet.ciiva.com/736/eng-cd-2132230-f-736027.pdf?src-supplier=Digi-Key; ComponentLink2Description: https://datasheet.ciiva.com/736/eng-cd-2132230-f-736027.pdf?src-supplier=Digi-Key; ComponentLink3URL: https://datasheet.ciiva.com/30153/790ddetrolleractionsrchrtrvdocnm7-1773461-6ep2-5doctypedatasheetd-30153803.pdf?src-supplier=Onlinecomponents.com; ComponentLink3Description: https://datasheet.ciiva.com/30153/790ddetrolleractionsrchrtrvdocnm7-1773461-6ep2-5doctypedatasheetd-30153803.pdf?src-supplier=Onlinecomponents.com; ComponentLink4URL: https://datasheet.ciiva.com/9528/eng-ds-7-1773461-6ep2-5-0615-9528616.pdf?src-supplier=Avnet; ComponentLink4Description: https://datasheet.ciiva.com/9528/eng-ds-7-1773461-6ep2-5-0615-9528616.pdf?src-supplier=Avnet
P10 P12 P14 = B2B-XH-AM(LF)(SN): Conn Shrouded Header (4 Sides) HDR 2 POS 2.5mm Solder ST Top Entry Thru-Hole Box; Manufacturer: JST; Manufacturer Part Number: B2B-XH-A(LF)(SN); Number of Positions: 2; Connector Type: Male Pin; Contact Resistance: 20mR; Max Current Rating: 3A; Max Voltage Rating (AC): 250V; Insulation Resistance: 1GR; Wire/Cable Gauge: 22AWG; Supplier 1: RSComponents; RoHS: Yes; Category: Headers and Wire Housings; Stock 1: 7000; Mount: Through Hole; Contact Plating: Tin,Copper,Lead; Color: Natural; Contact Material: Brass; Housing Color: White; Housing Material: Polyamide; Min Operating Temperature: -25°C; Max Operating Temperature: 85°C; Number of Rows: 1; Packaging: Bulk; Termination: Solder; Fastening Type: Detent; Current Rating: 3A; Orientation: Straight; Voltage Rating: 250V; Voltage Rating (AC): 250V; Number of Contacts: 2; Max Voltage Rating (DC): 250V; Length: 7.4mm; Pitch: 2.5mm; Depth: 5.75mm; Lead Pitch: 2.5mm; Lead Free: Lead Free; REACH SVHC: No SVHC; ComponentLink1URL: https://datasheet.ciiva.com/26894/getdatasheetpartid-640357-26894434.pdf?src-supplier=Verical; ComponentLink1Description: https://datasheet.ciiva.com/26894/getdatasheetpartid-640357-26894434.pdf?src-supplier=Verical; ComponentLink2URL: https://datasheet.ciiva.com/11746/0900766b8082653e-11746979.pdf?src-supplier=RSComponents; ComponentLink2Description: https://datasheet.ciiva.com/11746/0900766b8082653e-11746979.pdf?src-supplier=RSComponents; ComponentLink3URL: https://datasheet.ciiva.com/26894/getdatasheetpartid-385291-26894760.pdf?src-supplier=Verical; ComponentLink3Description: https://datasheet.ciiva.com/26894/getdatasheetpartid-385291-26894760.pdf?src-supplier=Verical; ComponentLink4URL: https://datasheet.ciiva.com/8052/5448-8052024.pdf?src-supplier=Element14; ComponentLink4Description: https://datasheet.ciiva.com/8052/5448-8052024.pdf?src-supplier=Element14; ComponentLink5URL: https://datasheet.ciiva.com/20207/523653-20207167.pdf?src-supplier=Rapid+Electronics; ComponentLink5Description: https://datasheet.ciiva.com/20207/523653-20207167.pdf?src-supplier=Rapid+Electronics; Supplier 2: Digi-Key; Stock 2: 7636; Pricing 2: 1=0,17000, 10=0,13100, 100=0,09660, 500=0,07998, 1000=0,06999, 5000=0,05999, 10000=0,05832 (USD); ComponentLink6URL: https://datasheet.ciiva.com/26894/getdatasheetpartid-640409-26894436.pdf?src-supplier=Verical; ComponentLink6Description: https://datasheet.ciiva.com/26894/getdatasheetpartid-640409-26894436.pdf?src-supplier=Verical; ComponentLink7URL: https://datasheet.ciiva.com/14800/exh-14800590.pdf?src-supplier=Digi-Key; ComponentLink7Description: https://datasheet.ciiva.com/14800/exh-14800590.pdf?src-supplier=Digi-Key
Q1 Q3 Q5 = IRF9530: P-Channel 100V 14A _Tc_ 79W _Tc_ Through Hole TO-220AB; MF: Vishay; Availability: Unavailable; Price: None; SnapEDA_Link: https://www.snapeda.com/parts/IRF9530/Vishay%20Siliconix/view-part/1770510/?ref=snap; Package: TO-220 Intersil; Value: *; MP: IRF9530
Q2 Q4 Q6 = BS170: N-Channel 60 V 500mA (Ta) 830mW (Ta) Through Hole TO-92-3; MF: ON Semiconductor; SnapEDA_Link: https://www.snapeda.com/parts/BS170/Onsemi/view-part/?ref=snap; Availability: In Stock; Purchase-URL: https://pricing.snapeda.com/search/part/BS170/?ref=eda; MP: BS170; Value: *; Price: None; Package: E-PKG AXIAL-LEADED-2 ON Semiconductor; Check_prices: https://www.snapeda.com/parts/BS170/Onsemi/view-part/?ref=eda
R1 R3-R5 R11-R13 R15 R16 = RC0805FR-1310KL: Res Thick Film 2.0 x 1.2 mm 10K Ohm 1% 0.125W(1/8W) 100ppm/ C Molded SMD Paper T/R; Manufacturer: Yageo; Resistance: 10kR; Power Rating: 125mW; Voltage Rating: 150V; Temperature Coefficient: 100ppm/°C; Supplier 1: Digi-Key; Manufacturer Part Number: RC0805FR-1310KL; RoHS: Yes; Category: Chip SMD Resistors; Stock 1: 79608; Pricing 1: 1=0,10000, 10=0,04200, 100=0,01690, 1000=0,00759, 2500=0,00659, 5000=0,00544 (USD); Case/Package: 0805; Number of Pins: 2; Case Code (Imperial): 0805; Case Code (Metric): 2012; Contact Plating: Tin,Matte,Lead; Min Operating Temperature: -55°C; Max Operating Temperature: 155°C; Tolerance: 1%; Packaging: Tape and Reel; Resistor Type: Thick Film; Termination: SMD/SMT; Voltage Rating (DC): 150V; Series: RC; Resistance Tolerance: 1%; Radiation Hardening: No; REACH SVHC: No SVHC; Lead Free: Lead Free; RoHS Compliant: Yes; ComponentLink1URL: http://www.mouser.com/ds/2/447/Yageo_08112016_RC0805-968729.pdf?src-supplier=Mouser; ComponentLink1Description: http://www.mouser.com/ds/2/447/Yageo_08112016_RC0805-968729.pdf?src-supplier=Mouser; ComponentLink2URL: http://components.arrow.com/part/dataview/0323_00200993?src-supplier=Arrow+Europe; ComponentLink2Description: http://components.arrow.com/part/dataview/0323_00200993?src-supplier=Arrow+Europe; ComponentLink3URL: http://www.farnell.com/datasheets/2167052.pdf?src-supplier=Farnell; ComponentLink3Description: http://www.farnell.com/datasheets/2167052.pdf?src-supplier=Farnell; ComponentLink4URL: http://www.farnell.com/datasheets/2167052.pdf?src-supplier=Element14; ComponentLink4Description: http://www.farnell.com/datasheets/2167052.pdf?src-supplier=Element14; ComponentLink5URL: http://www.farnell.com/datasheets/2167052.pdf?src-supplier=Newark; ComponentLink5Description: http://www.farnell.com/datasheets/2167052.pdf?src-supplier=Newark; ComponentLink6URL: http://www.yageo.com/pdf/PYu-RC0805_51_RoHS_L_4.pdf?src-supplier=Avnet; ComponentLink6Description: http://www.yageo.com/pdf/PYu-RC0805_51_RoHS_L_4.pdf?src-supplier=Avnet; ComponentLink7URL: http://www.yageo.com/documents/recent/PYu-RC0805_51_RoHS_L_5.pdf?src-supplier=Avnet+Europe; ComponentLink7Description: http://www.yageo.com/documents/recent/PYu-RC0805_51_RoHS_L_5.pdf?src-supplier=Avnet+Europe; Supplier Part Number 1: 13-RC0805FR-1310KLCT-ND
R2 R6 R14 = 2.2k dip: Manufacturer: Vishay; Manufacturer Part Number: CRCW06032K20FKEAHP; Resistance: 2.2kR; Temperature Coefficient: 100ppm/°C; Power Rating: 250mW; Voltage Rating: 75V; RoHS: Yes; Category: Chip SMD Resistors; Stock 1: 19777; Pricing 1: 1=0,17000, 10=0,14800, 100=0,05790, 1000=0,02422, 2500=0,02220 (USD); Mount: Surface Mount; Case/Package: 0603; Contact Plating: Tin; Case Code (Metric): 1608; Case Code (Imperial): 0603; Min Operating Temperature: -55°C; Max Operating Temperature: 155°C; Tolerance: 1%; Resistor Type: Thick Film; Packaging: Tape and Reel; Package Quantity: 1; Number of Terminations: 2; Termination: Solder; Max Power Dissipation: 250mW; Voltage Rating (DC): 75V; Features: Automotive AEC-Q200; Series: CRCW-HP; Construction: Rectangular; Technology: THICK FILM; Resistance Tolerance: 1%; Length: 1.6mm; Width: 0.033inch; Height: 0.02inch; Depth: 0.85mm; Radiation Hardening: No; REACH SVHC: Unknown; Military Standard: Not; Lead Free: Lead Free; RoHS Compliant: Yes
R21-R23 = RT1206BRD0749R9L: as R17 on sheet STMH7; Part Number: RT1206BRD0749R9L; ComponentLink1Description: Datasheet; ComponentLink1URL: https://www.yageo.com/upload/media/product/productsearch/datasheet/rchip/PYu-RT_1-to-0.01_RoHS_L_11.pdf; ComponentLink2Description: DigiKey Link; ComponentLink2URL: https://www.digikey.com/en/products/detail/yageo/RT1206BRD0749R9L/1079849; Composition: Thin Film; Device Package: 1206 (3216 Metric); Height - Seated (Max): 0.026" (0.65mm); LastUpdated: 4.08.2022 05:00:43; Lifecycle Status: Active; Minimum Order: 1; Number of Terminations: 2; Operating Temperature: -55°C ~ 155°C; Package / Case: 1206 (3216 Metric); Packaging: TapeAndReel; PartId: 26863; Part Status: Active; Price: 0.10; Series: RT; Size / Dimension: 0.122" L x 0.063" W (3.10mm x 1.60mm); Supplier 1: DigiKey; Supplier Part Number 1: YAG5080CT-ND; Supplier Device Package: 1206; Tolerance: ±0.1%

## Sheet POWER.SchDoc
size A4
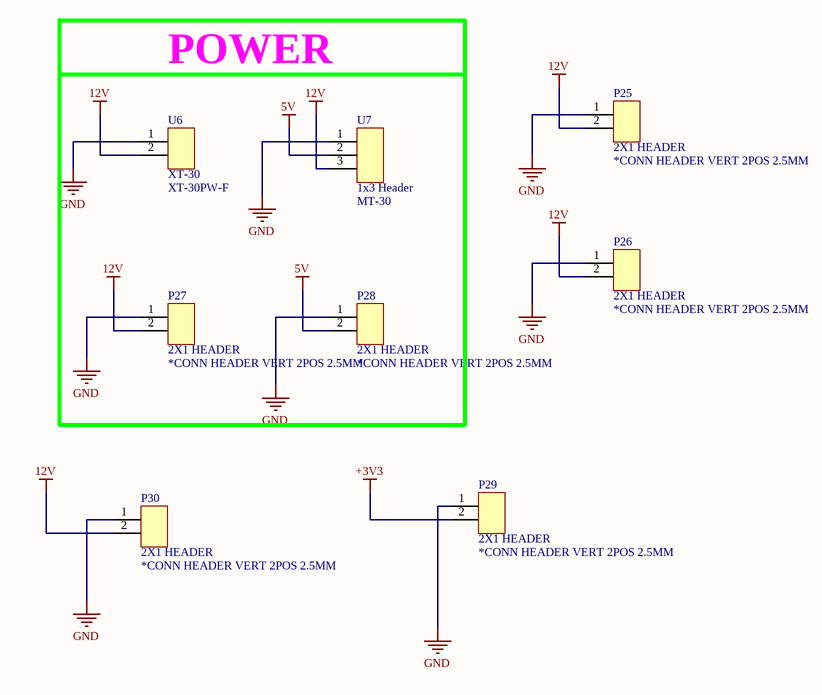
[diagram p7: POWER.SchDoc]

### Parts
P25  *CONN HEADER VERT 2POS 2.5MM  [51025-02-0100-01]
P26  *CONN HEADER VERT 2POS 2.5MM  [51025-02-0100-01]
P27  *CONN HEADER VERT 2POS 2.5MM  [51025-02-0100-01]
P28  *CONN HEADER VERT 2POS 2.5MM  [51025-02-0100-01]
P29  *CONN HEADER VERT 2POS 2.5MM  [51025-02-0100-01]
P30  *CONN HEADER VERT 2POS 2.5MM  [51025-02-0100-01]
U6  XT-30PW-F  [XT-30PW-F]
U7  MT-30  [MT-30]

### Blocks framed on the sheet
POWER: P27 P28 U6 U7

### Nets
5V: P28.2 U7.2
12V: P25.2 P26.2 P27.2 P30.2 U6.2 U7.3
+3V3: P29.2
GND: P25.1 P26.1 P27.1 P28.1 P29.1 P30.1 U6.1 U7.1

### Notes on the sheet
- (in symbol B2B-XH-AM(LF)(SN)) 2X1 HEADER
- (in symbol MT-30) 1x3 Header
- (in symbol XT-30PW-F) XT-30

### Library data of the parts
P25-P30 = B2B-XH-AM(LF)(SN): as P10 on sheet HSS; Supplier 1: RSComponents; RoHS: Yes; Category: Headers and Wire Housings; Stock 1: 7000; Mount: Through Hole; Contact Plating: Tin,Copper,Lead; Color: Natural; Contact Material: Brass; Housing Color: White; Housing Material: Polyamide; Min Operating Temperature: -25°C; Max Operating Temperature: 85°C; Number of Rows: 1; Packaging: Bulk; Termination: Solder; Fastening Type: Detent; Current Rating: 3A; Orientation: Straight; Voltage Rating: 250V; Voltage Rating (AC): 250V; Number of Contacts: 2; Max Voltage Rating (DC): 250V; Length: 7.4mm; Pitch: 2.5mm; Depth: 5.75mm; Lead Pitch: 2.5mm; Lead Free: Lead Free; REACH SVHC: No SVHC; ComponentLink1URL: https://datasheet.ciiva.com/26894/getdatasheetpartid-640357-26894434.pdf?src-supplier=Verical; ComponentLink1Description: https://datasheet.ciiva.com/26894/getdatasheetpartid-640357-26894434.pdf?src-supplier=Verical; ComponentLink2URL: https://datasheet.ciiva.com/11746/0900766b8082653e-11746979.pdf?src-supplier=RSComponents; ComponentLink2Description: https://datasheet.ciiva.com/11746/0900766b8082653e-11746979.pdf?src-supplier=RSComponents; ComponentLink3URL: https://datasheet.ciiva.com/26894/getdatasheetpartid-385291-26894760.pdf?src-supplier=Verical; ComponentLink3Description: https://datasheet.ciiva.com/26894/getdatasheetpartid-385291-26894760.pdf?src-supplier=Verical; ComponentLink4URL: https://datasheet.ciiva.com/8052/5448-8052024.pdf?src-supplier=Element14; ComponentLink4Description: https://datasheet.ciiva.com/8052/5448-8052024.pdf?src-supplier=Element14; ComponentLink5URL: https://datasheet.ciiva.com/20207/523653-20207167.pdf?src-supplier=Rapid+Electronics; ComponentLink5Description: https://datasheet.ciiva.com/20207/523653-20207167.pdf?src-supplier=Rapid+Electronics; Supplier 2: Digi-Key; Stock 2: 7636; Pricing 2: 1=0,17000, 10=0,13100, 100=0,09660, 500=0,07998, 1000=0,06999, 5000=0,05999, 10000=0,05832 (USD); ComponentLink6URL: https://datasheet.ciiva.com/26894/getdatasheetpartid-640409-26894436.pdf?src-supplier=Verical; ComponentLink6Description: https://datasheet.ciiva.com/26894/getdatasheetpartid-640409-26894436.pdf?src-supplier=Verical; ComponentLink7URL: https://datasheet.ciiva.com/14800/exh-14800590.pdf?src-supplier=Digi-Key; ComponentLink7Description: https://datasheet.ciiva.com/14800/exh-14800590.pdf?src-supplier=Digi-Key

## Nets that join several sheets
5V: STMH7 (C9.1 P24.1), RS232-U4_U7 (P1.1 P3.1 U1.16), RS232-U5_U6 (7 pins), PWM (P16.1 P16.4 P16.7 P16.10), ADC (P15.1 P15.3), HSS (P9.1 P11.1 P13.1), POWER (P28.2 U7.2)
12V: RS232-U4_U7 (P1.3 P3.3), HSS (P9.3 P11.3 P13.3), POWER (6 pins)
+3V3: STMH7 (IC1.3 IC1.4), I2C (6 pins), POWER (P29.2)
GND: STMH7 (15 pins), RS232-U4_U7 (6 pins), RS232-U5_U6 (7 pins), PWM (P16.3 P16.6 P16.9 P16.12), I2C (P17.4 P18.4), ADC (P15.9 P15.11), HSS (18 pins), POWER (8 pins)
ADC_1: STMH7 (IC1.72), ADC (P15.5)
ADC_2: STMH7 (IC1.70), ADC (P15.7)
HSS_IN1: STMH7 (IC1.67), HSS (R14.1)
HSS_IN2: STMH7 (IC1.65), HSS (R6.1)
HSS_IN3: STMH7 (IC1.63), HSS (R2.1)
PWM1: STMH7 (IC1.59), PWM (P16.2)
PWM2: STMH7 (IC1.78), PWM (P16.5)
PWM3: STMH7 (IC1.37), PWM (P16.8)
PWM4: STMH7 (IC1.12), PWM (P16.11)
SCL_2: STMH7 (IC1.56), I2C (P17.2 R10.1)
SCL_4: STMH7 (IC1.40), I2C (P18.2 R8.1)
SDA_2: STMH7 (IC1.55), I2C (P17.3 R9.1)
SDA_4: STMH7 (IC1.39), I2C (P18.3 R7.1)
UART1_RX: STMH7 (IC1.51), RS232-U5_U6 (P21.2)
UART1_TX: STMH7 (IC1.52), RS232-U5_U6 (P21.3)
UART2_RX: STMH7 (IC1.75), RS232-U5_U6 (P22.2)
UART2_TX: STMH7 (IC1.76), RS232-U5_U6 (P22.3)
UART3_RX: STMH7 (IC1.7), RS232-U5_U6 (P23.2)
UART3_TX: STMH7 (IC1.8), RS232-U5_U6 (P23.3)
UART4_RX: STMH7 (IC1.21), RS232-U4_U7 (P4.3 U1.9)
UART4_TX: STMH7 (IC1.24), RS232-U4_U7 (P4.1 U1.10)
UART5_RX: STMH7 (IC1.54), RS232-U5_U6 (U5.12)
UART5_TX: STMH7 (IC1.53), RS232-U5_U6 (U5.11)
UART6_RX: STMH7 (IC1.15), RS232-U5_U6 (U5.9)
UART6_TX: STMH7 (IC1.16), RS232-U5_U6 (U5.10)
UART7_RX: STMH7 (IC1.35), RS232-U4_U7 (P7.3 U1.12)
UART7_TX: STMH7 (IC1.23), RS232-U4_U7 (P7.1 U1.11)